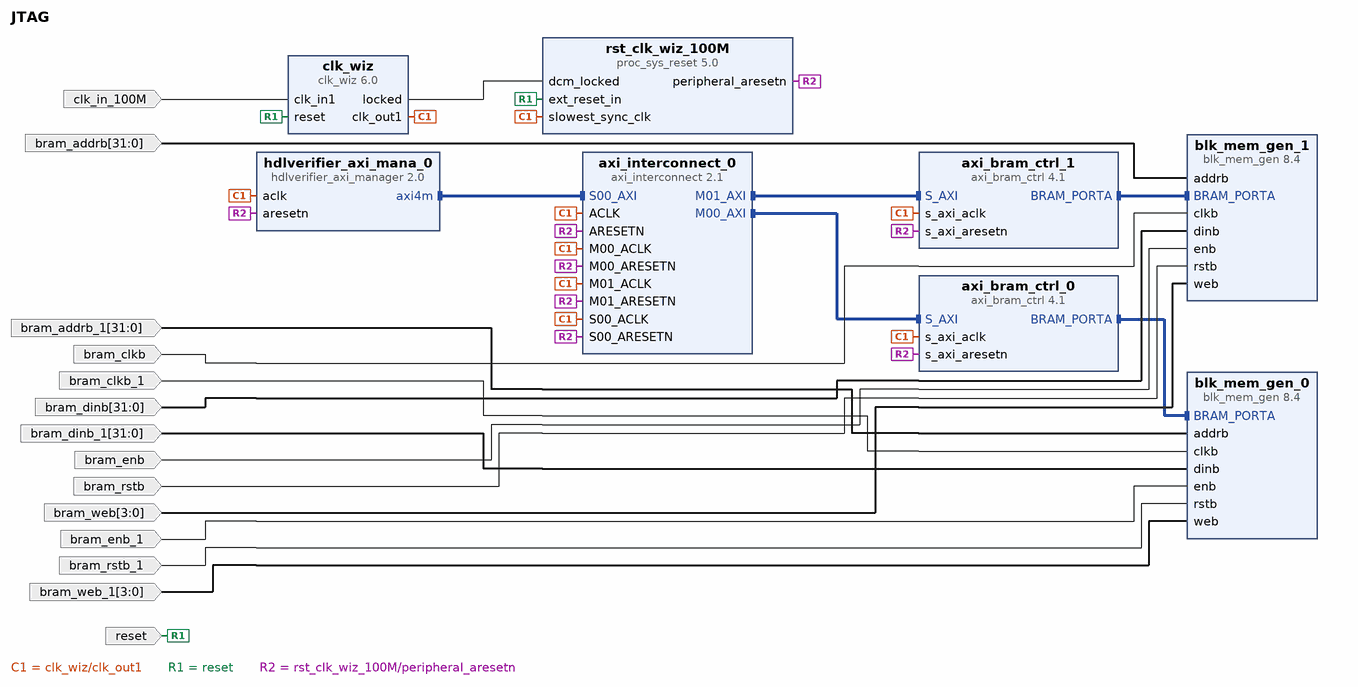
[diagram p0: block diagram of the top level]
# Vivado block design JTAG, xcku5p-ffvb676-2-e, Vivado 2022.1
create_bd_design JTAG

create_bd_port -dir I -type clk clk_in_100M
set_property -dict {CONFIG.FREQ_HZ 100000000} [get_bd_ports clk_in_100M]
create_bd_port -dir I -type rst reset
set_property -dict {CONFIG.POLARITY ACTIVE_HIGH} [get_bd_ports reset]
create_bd_port -dir I -from 31 -to 0 -type data bram_addrb
create_bd_port -dir I -type clk bram_clkb
set_property -dict {CONFIG.FREQ_HZ 100000000} [get_bd_ports bram_clkb]
create_bd_port -dir I -type rst bram_rstb
set_property -dict {CONFIG.POLARITY ACTIVE_HIGH} [get_bd_ports bram_rstb]
create_bd_port -dir I -type data bram_enb
create_bd_port -dir I -from 31 -to 0 -type data bram_dinb
create_bd_port -dir I -from 3 -to 0 -type data bram_web
create_bd_port -dir I -type clk bram_clkb_1
set_property -dict {CONFIG.FREQ_HZ 100000000} [get_bd_ports bram_clkb_1]
create_bd_port -dir I bram_enb_1
create_bd_port -dir I -type rst bram_rstb_1
set_property -dict {CONFIG.POLARITY ACTIVE_HIGH} [get_bd_ports bram_rstb_1]
create_bd_port -dir I -from 31 -to 0 bram_addrb_1
create_bd_port -dir I -from 31 -to 0 -type data bram_dinb_1
create_bd_port -dir I -from 3 -to 0 -type data bram_web_1

create_bd_cell -type ip -vlnv mathworks.com:ip:hdlverifier_axi_manager:2.0 hdlverifier_axi_mana_0
create_bd_cell -type ip -vlnv xilinx.com:ip:axi_interconnect:2.1 axi_interconnect_0
set_property -dict {CONFIG.NUM_MI 2} [get_bd_cells axi_interconnect_0]
create_bd_cell -type ip -vlnv xilinx.com:ip:clk_wiz:6.0 clk_wiz
set_property -dict [list \
  CONFIG.CLKOUT1_JITTER 115.831 \
  CONFIG.CLKOUT1_REQUESTED_OUT_FREQ 100 \
  CONFIG.MMCM_CLKOUT0_DIVIDE_F 12.000 \
  CONFIG.RESET_BOARD_INTERFACE reset \
  CONFIG.USE_BOARD_FLOW true \
] [get_bd_cells clk_wiz]
create_bd_cell -type ip -vlnv xilinx.com:ip:proc_sys_reset:5.0 rst_clk_wiz_100M
set_property -dict {CONFIG.RESET_BOARD_INTERFACE reset CONFIG.USE_BOARD_FLOW true} [get_bd_cells rst_clk_wiz_100M]
create_bd_cell -type ip -vlnv xilinx.com:ip:blk_mem_gen:8.4 blk_mem_gen_1
set_property -dict [list \
  CONFIG.EN_SAFETY_CKT true \
  CONFIG.Enable_32bit_Address true \
  CONFIG.Enable_B Use_ENB_Pin \
  CONFIG.Memory_Type True_Dual_Port_RAM \
  CONFIG.Port_B_Clock 100 \
  CONFIG.Port_B_Enable_Rate 100 \
  CONFIG.Port_B_Write_Rate 50 \
  CONFIG.Read_Width_A 32 \
  CONFIG.Read_Width_B 32 \
  CONFIG.Register_PortA_Output_of_Memory_Primitives false \
  CONFIG.Register_PortB_Output_of_Memory_Primitives false \
  CONFIG.Use_RSTA_Pin true \
  CONFIG.Use_RSTB_Pin true \
  CONFIG.Write_Width_A 32 \
  CONFIG.Write_Width_B 32 \
  CONFIG.use_bram_block BRAM_Controller \
] [get_bd_cells blk_mem_gen_1]
create_bd_cell -type ip -vlnv xilinx.com:ip:axi_bram_ctrl:4.1 axi_bram_ctrl_1
set_property -dict {CONFIG.DATA_WIDTH 32 CONFIG.SINGLE_PORT_BRAM 1} [get_bd_cells axi_bram_ctrl_1]
create_bd_cell -type ip -vlnv xilinx.com:ip:axi_bram_ctrl:4.1 axi_bram_ctrl_0
set_property -dict {CONFIG.SINGLE_PORT_BRAM 1} [get_bd_cells axi_bram_ctrl_0]
create_bd_cell -type ip -vlnv xilinx.com:ip:blk_mem_gen:8.4 blk_mem_gen_0
set_property -dict [list \
  CONFIG.EN_SAFETY_CKT true \
  CONFIG.Enable_32bit_Address true \
  CONFIG.Enable_B Use_ENB_Pin \
  CONFIG.Memory_Type True_Dual_Port_RAM \
  CONFIG.Port_B_Clock 100 \
  CONFIG.Port_B_Enable_Rate 100 \
  CONFIG.Port_B_Write_Rate 50 \
  CONFIG.Register_PortA_Output_of_Memory_Primitives false \
  CONFIG.Use_RSTA_Pin true \
  CONFIG.Use_RSTB_Pin true \
  CONFIG.use_bram_block BRAM_Controller \
] [get_bd_cells blk_mem_gen_0]

# ---- connections ----

connect_bd_intf_net [get_bd_intf_pins axi_bram_ctrl_0/BRAM_PORTA] [get_bd_intf_pins blk_mem_gen_0/BRAM_PORTA]
connect_bd_intf_net [get_bd_intf_pins axi_bram_ctrl_1/BRAM_PORTA] [get_bd_intf_pins blk_mem_gen_1/BRAM_PORTA]
connect_bd_intf_net [get_bd_intf_pins axi_interconnect_0/M00_AXI] [get_bd_intf_pins axi_bram_ctrl_0/S_AXI]
connect_bd_intf_net [get_bd_intf_pins axi_interconnect_0/M01_AXI] [get_bd_intf_pins axi_bram_ctrl_1/S_AXI]
connect_bd_intf_net [get_bd_intf_pins hdlverifier_axi_mana_0/axi4m] [get_bd_intf_pins axi_interconnect_0/S00_AXI]
connect_bd_net [get_bd_ports bram_addrb] [get_bd_pins blk_mem_gen_1/addrb]
connect_bd_net -net bram_addrb_1_1 [get_bd_ports bram_addrb_1] [get_bd_pins blk_mem_gen_0/addrb]
connect_bd_net [get_bd_ports bram_clkb] [get_bd_pins blk_mem_gen_1/clkb]
connect_bd_net -net bram_clkb_1_1 [get_bd_ports bram_clkb_1] [get_bd_pins blk_mem_gen_0/clkb]
connect_bd_net [get_bd_ports bram_dinb] [get_bd_pins blk_mem_gen_1/dinb]
connect_bd_net -net bram_dinb_1_1 [get_bd_ports bram_dinb_1] [get_bd_pins blk_mem_gen_0/dinb]
connect_bd_net [get_bd_ports bram_enb] [get_bd_pins blk_mem_gen_1/enb]
connect_bd_net -net bram_enb_1_1 [get_bd_ports bram_enb_1] [get_bd_pins blk_mem_gen_0/enb]
connect_bd_net [get_bd_ports bram_rstb] [get_bd_pins blk_mem_gen_1/rstb]
connect_bd_net -net bram_rstb_1_1 [get_bd_ports bram_rstb_1] [get_bd_pins blk_mem_gen_0/rstb]
connect_bd_net [get_bd_ports bram_web] [get_bd_pins blk_mem_gen_1/web]
connect_bd_net -net bram_web_1_1 [get_bd_ports bram_web_1] [get_bd_pins blk_mem_gen_0/web]
connect_bd_net [get_bd_ports clk_in_100M] [get_bd_pins clk_wiz/clk_in1]
connect_bd_net [get_bd_pins clk_wiz/clk_out1] \
  [get_bd_pins hdlverifier_axi_mana_0/aclk] [get_bd_pins axi_interconnect_0/S00_ACLK] \
  [get_bd_pins rst_clk_wiz_100M/slowest_sync_clk] [get_bd_pins axi_interconnect_0/M00_ACLK] \
  [get_bd_pins axi_interconnect_0/ACLK] [get_bd_pins axi_bram_ctrl_1/s_axi_aclk] [get_bd_pins axi_bram_ctrl_0/s_axi_aclk] \
  [get_bd_pins axi_interconnect_0/M01_ACLK]
connect_bd_net [get_bd_pins clk_wiz/locked] [get_bd_pins rst_clk_wiz_100M/dcm_locked]
connect_bd_net [get_bd_ports reset] [get_bd_pins clk_wiz/reset] [get_bd_pins rst_clk_wiz_100M/ext_reset_in]
connect_bd_net [get_bd_pins rst_clk_wiz_100M/peripheral_aresetn] \
  [get_bd_pins hdlverifier_axi_mana_0/aresetn] [get_bd_pins axi_interconnect_0/S00_ARESETN] \
  [get_bd_pins axi_interconnect_0/M00_ARESETN] [get_bd_pins axi_interconnect_0/ARESETN] \
  [get_bd_pins axi_bram_ctrl_1/s_axi_aresetn] [get_bd_pins axi_bram_ctrl_0/s_axi_aresetn] \
  [get_bd_pins axi_interconnect_0/M01_ARESETN]

# ---- address map ----
assign_bd_address -offset 0xC0000000 -range 8K -target_address_space [get_bd_addr_spaces hdlverifier_axi_mana_0/axi4m] [get_bd_addr_segs axi_bram_ctrl_1/S_AXI/Mem0]
assign_bd_address -offset 0xC2000000 -range 8K -target_address_space [get_bd_addr_spaces hdlverifier_axi_mana_0/axi4m] [get_bd_addr_segs axi_bram_ctrl_0/S_AXI/Mem0]

validate_bd_design
save_bd_design
